# EAGLE design Breakout_AMT630 (EAGLE 8.3.2)
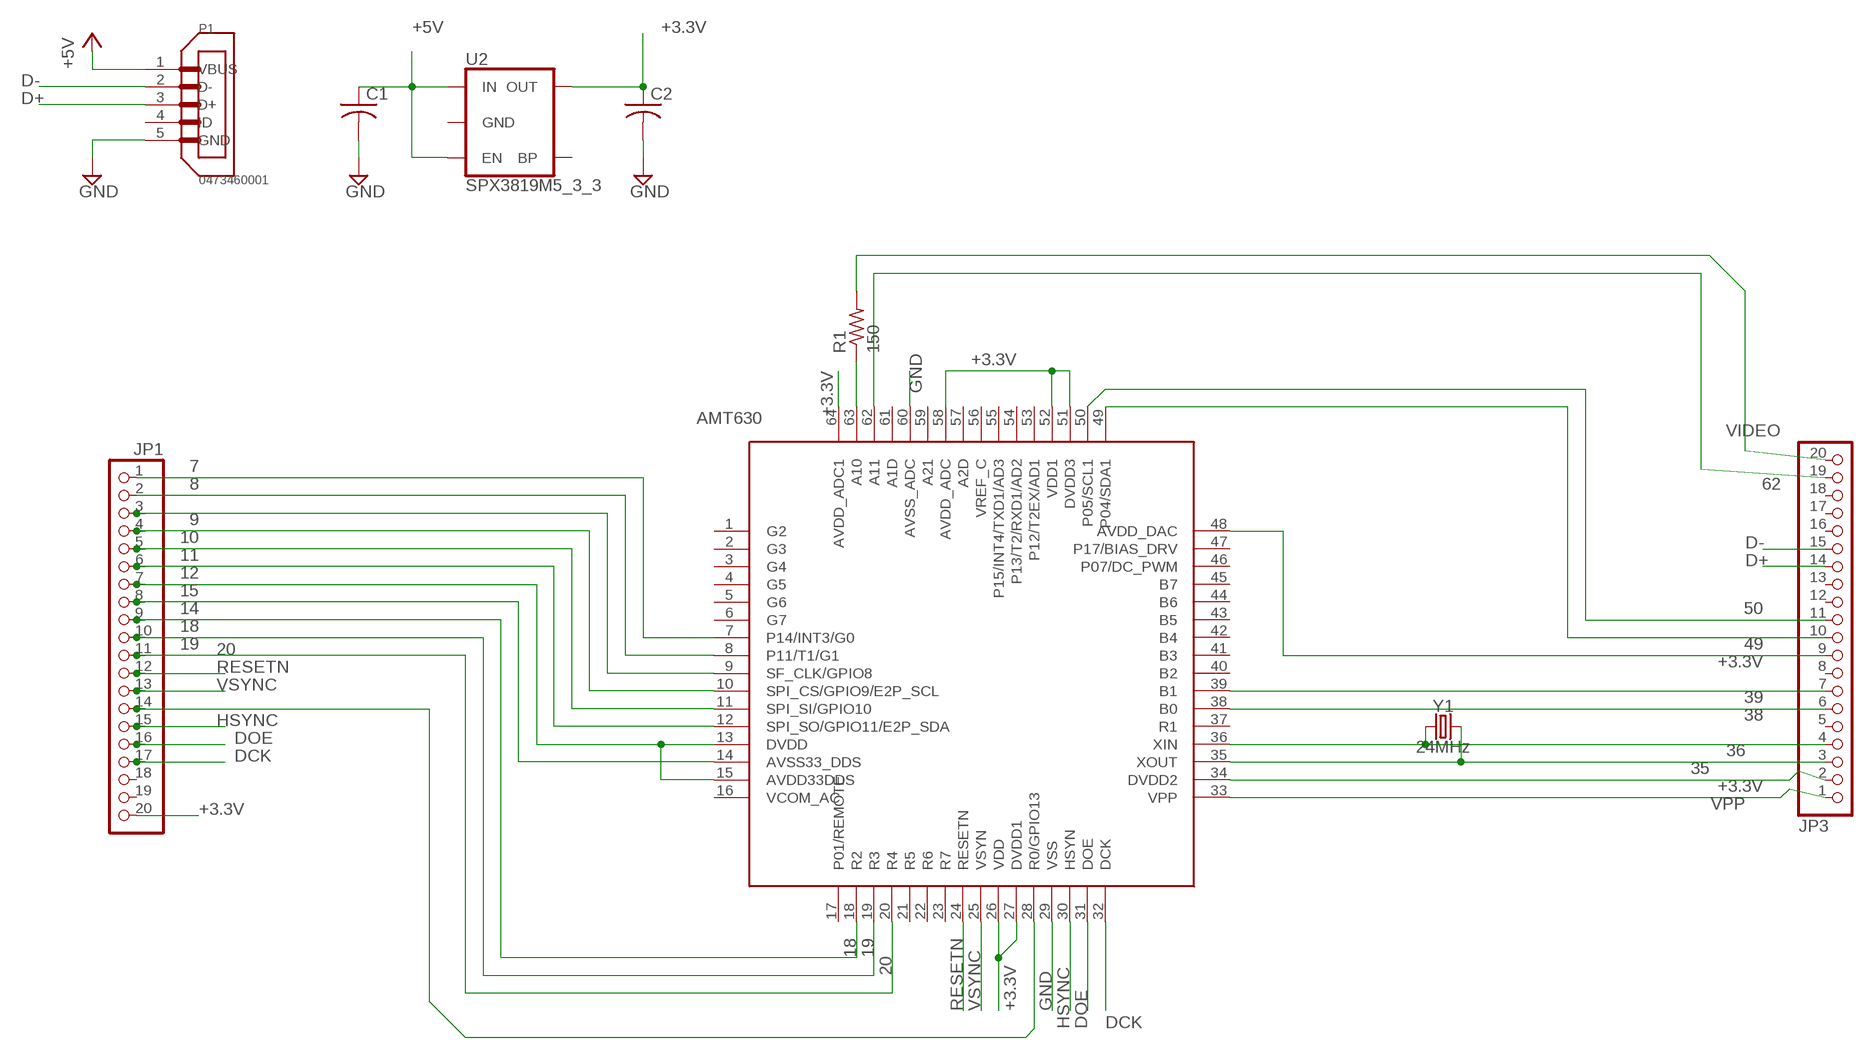
[diagram p0: schematic, sheet 1]

## Parts
C1  C-USC0402  [C0402]
C2  C-USC0402  [C0402]
JP1  PINHD-1X20-BIG  [1X20-BIG]
JP3  PINHD-1X20-BIG  [1X20-BIG]
P1  0473460001  [MOLEX_0473460001]
R1  150  R-US_R0402  [R0402]
U1  AMT630  [QFP50P1200X1200X160-64N]
U2  SPX3819M5_3_3  V_REG_SPX3819-SOT23-5  [SOT23-5]
Y1  24MHz  CRYSTAL-24MHZ"  [CRYSTAL-SMD-5X3.2-4PAD]

## Nets
7: JP1.1 U1.7(P14/INT3/G0)
8: JP1.2 U1.8(P11/T1/G1)
9: JP1.3 U1.9(SF_CLK/GPIO8)
10: JP1.4 U1.10(SPI_CS/GPIO9/E2P_SCL)
11: JP1.5 U1.11(SPI_SI/GPIO10)
12: JP1.6 U1.12(SPI_SO/GPIO11/E2P_SDA)
14: JP1.8 U1.14(AVSS33_DDS)
15: JP1.7 U1.13(DVDD) U1.15(AVDD33DDS)
18: JP1.9 U1.18(R2)
19: JP1.10 U1.19(R3)
20: JP1.11 U1.20(R4)
28: JP1.14 U1.28(R0/GPIO13)
35: JP3.3 U1.35(XOUT) Y1.3
36: JP3.4 U1.36(XIN) Y1.1
38: JP3.6 U1.38(B0)
39: JP3.7 U1.39(B1)
49: JP3.10 U1.49(P04/SDA1)
50: JP3.11 U1.50(P05/SCL1)
62: JP3.19 U1.62(A11)
+3.3V: C2.1 JP1.20 JP3.2 JP3.9 U1.26(VDD) U1.27(DVDD1) U1.34(DVDD2) U1.48(AVDD_DAC) U1.51(DVDD3) U1.52(VDD1) U1.58(AVDD_ADC) U1.64(AVDD_ADC1) U2.5(OUT)
+5V: C1.1 P1.1(VBUS) U2.1(IN) U2.3(EN)
D+: JP3.14 P1.3(D+)
D-: JP3.15 P1.2(D-)
DCK: JP1.17 U1.32(DCK)
DOE: JP1.16 U1.31(DOE)
GND: C1.2 C2.2 P1.5(GND) U1.29(VSS) U1.60(AVSS_ADC)
HSYNC: JP1.15 U1.30(HSYN)
N$15: R1.1 U1.63(A10)
RESETN: JP1.12 U1.24(RESETN)
VIDEO: JP3.20 R1.2
VPP: JP3.1 U1.33(VPP)
VSYNC: JP1.13 U1.25(VSYN)
Unconnected: JP1.18 JP1.19 JP3.5 JP3.8 JP3.12 JP3.13 JP3.16 JP3.17 JP3.18 P1.4(ID) U1.1(G2) U1.2(G3) U1.3(G4) U1.4(G5) U1.5(G6) U1.6(G7) U1.16(VCOM_AC) U1.17(P01/REMOTE) U1.21(R5) U1.22(R6) U1.23(R7) U1.37(R1) U1.40(B2) U1.41(B3) U1.42(B4) U1.43(B5) U1.44(B6) U1.45(B7) U1.46(P07/DC_PWM) U1.47(P17/BIAS_DRV) U1.53(P12/T2EX/AD1) U1.54(P13/T2/RXD1/AD2) U1.55(P15/INT4/TXD1/AD3) U1.56(VREF_C) U1.57(A2D) U1.59(A21) U1.61(A1D) U2.2(GND) U2.4(BP)

## Library data of the parts
C1 C2 = adafruit:C-US: CAPACITOR, American symbol
JP1 JP3 = adafruit:PINHD-1X20: PIN HEADER
P1 = 0473460001:0473460001: Conn Micro USB Type B RCP 5 POS 0.65mm Solder RA SMD 5 Terminal 1 Port T/R; AVAILABILITY: Good; DESCRIPTION: DEK 5 FW 1-50. Terminal markers, Card, 5 x 5 mm, Polyamide, Colour: White GTIN (EAN): 4008190135157; MF: Weidmuller; MP: 0473460001; PACKAGE: None; PRICE: 2.87 USD
R1 = rcl:R-US_: RESISTOR, American symbol
U1 = amt630:AMT630; OC_NEWARK: unknown
U2 = SparkFun-IC-Power:V_REG_SPX3819: SPX3819 Voltage Regulator 3.3V 500mA, 16V input Datasheet <https://www.exar.com/content/document.ashx?id=22106> SparkFun Products: SparkFun Serial Controlled Motor Driver <https://www.sparkfun.com/products/13911>; PROD_ID: VREG-13321
Y1 = SparkFun-Clocks:CRYSTAL-24MHZ: 24MHz Crystal Datasheet <http://www.sparkfun.com/datasheets/Components/AT-SMD-5x3.pdf> Frequency: 24MHz Frequency Tolerance: ±20ppm Load Capacitance: 12pF SparkFun Products: USB Bit Whacker <https://www.sparkfun.com/products/762>; PROD_ID: XTAL-08298; SF_ID: COM-08581

## Board
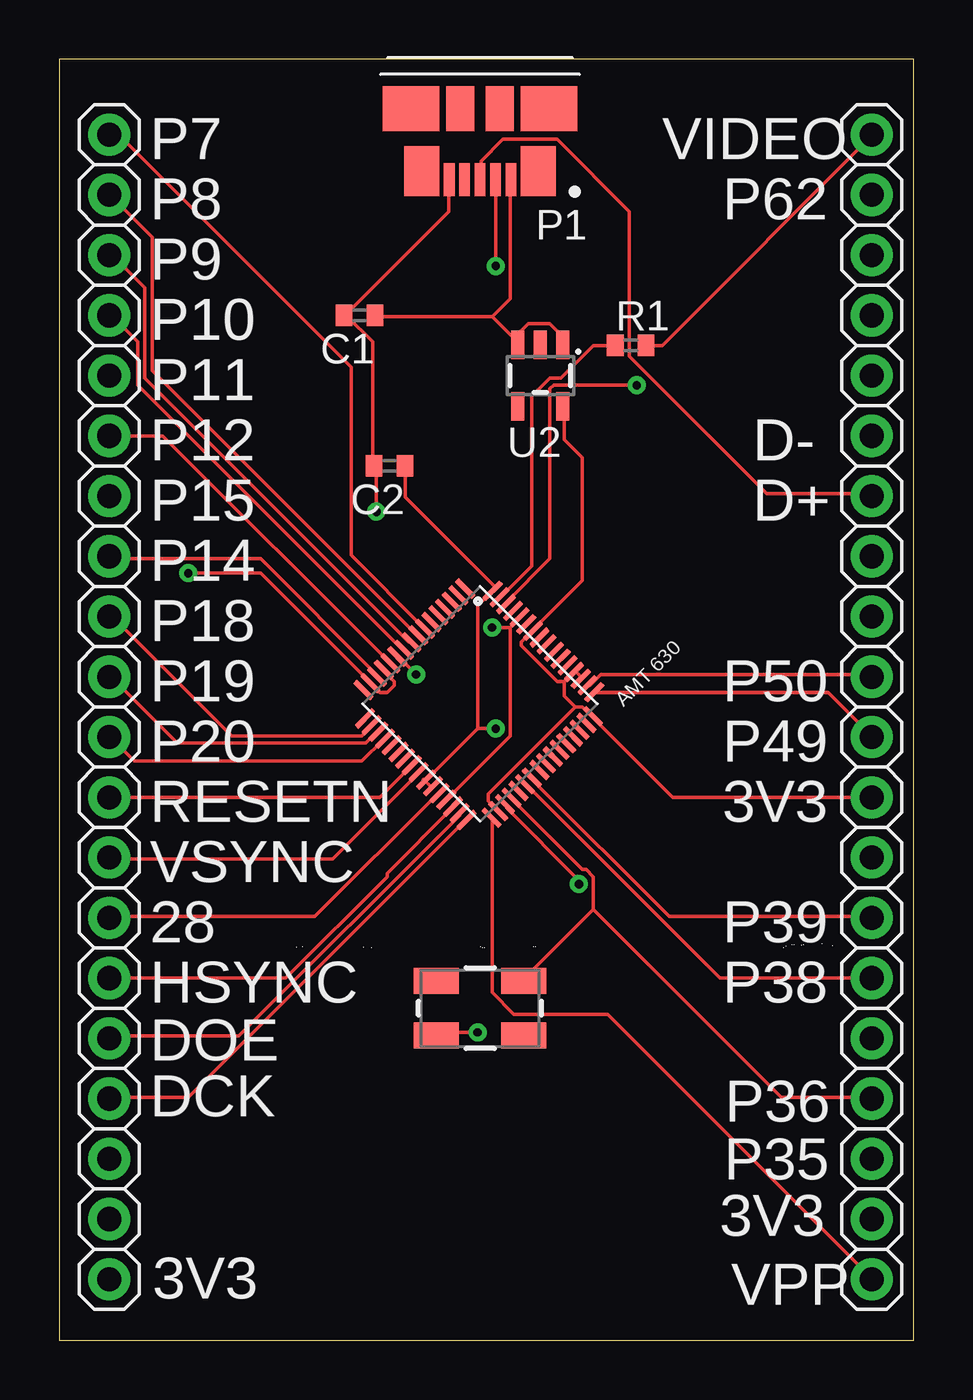
[diagram p1: board, top side]
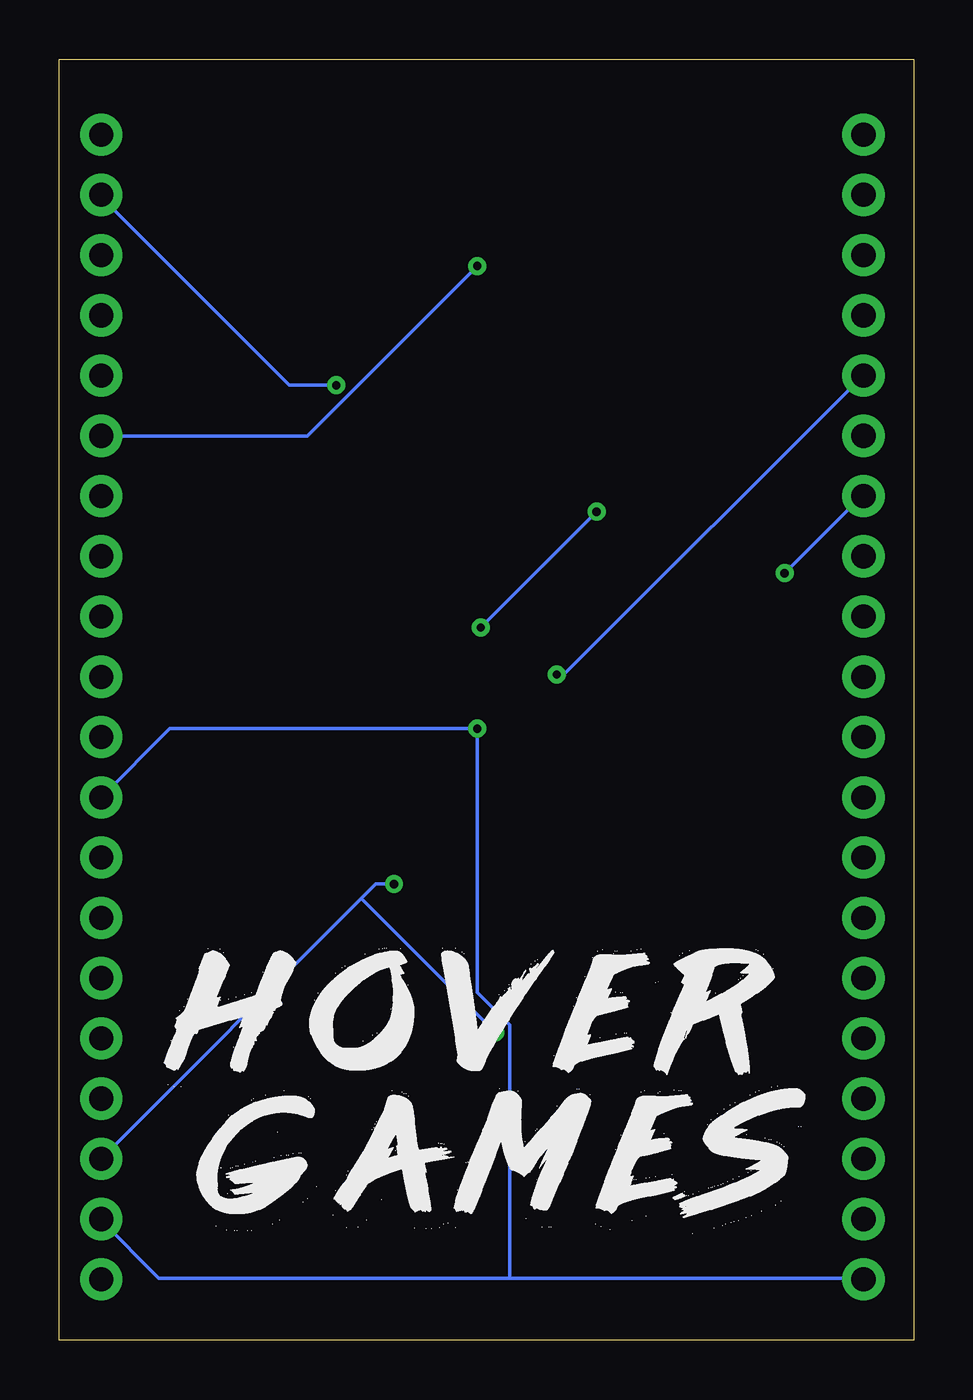
[diagram p2: board, bottom side, seen from below]

Size 36 x 54 mm. Coordinates in mm from the lower left corner, seen from the top.
Outline: 0,0 36,0 36,54 0,54 0,0
Copper layers (1*16): Top 0.035mm / dielectric 1.5mm / Bottom 0.035mm
Design rules "default": minimum track width 6mil, minimum drill 0.35mm, track to track 6mil, track to pad 6mil, pad to pad 6mil, via to via 6mil, smd to smd 6mil, copper to edge 40mil, drill to drill 6mil, minimum pad ring 10mil, minimum via ring 8mil, stop-mask expansion 4mil, vias tented up to drill 0mil, thermal gap 10mil

### Footprints (pad centres in the part's own frame; a part is rotated, then mirrored left to right if it is on the bottom)
C0402 = smd 0.7 x 0.9: 1 -0.65,0; 2 0.65,0
1X20-BIG = drill 1.016 pad 1.778: 1 -24.13,0; 2 -21.59,0; 3 -19.05,0; 4 -16.51,0; 5 -13.97,0; 6 -11.43,0; 7 -8.89,0; 8 -6.35,0; 9 -3.81,0; 10 -1.27,0; 11 1.27,0; 12 3.81,0; 13 6.35,0; 14 8.89,0; 15 11.43,0; 16 13.97,0; 17 16.51,0; 18 19.05,0; 19 21.59,0; 20 24.13,0
MOLEX_0473460001 = smd 0.45 x 1.38: 1 -1.3,0; 2 -0.65,0; 3 0,0; 4 0.65,0; 5 1.3,0 | smd 1.475 x 2.1: P1 -2.462,-0.36; P2 2.462,-0.36 | smd 2.375 x 1.9: P3 -2.913,-2.99; P6 2.913,-2.99 | smd 1.175 x 1.9: P4 -0.838,-2.99; P5 0.838,-2.99
R0402 = smd 0.7 x 0.9: 1 -0.65,0; 2 0.65,0
QFP50P1200X1200X160-64N = smd 0.2 x 0.998: 1 0.502,-0.381; 2 0.901,-0.381; 3 1.301,-0.381; 4 1.701,-0.381; 5 2.101,-0.381; 6 2.501,-0.381; 7 2.9,-0.381; 8 3.3,-0.381; 9 3.7,-0.381; 10 4.154,-0.381; 11 4.554,-0.381; 12 4.954,-0.381; 13 5.353,-0.381; 14 5.753,-0.381; 15 6.153,-0.381; 16 6.553,-0.381; 33 6.553,7.239; 34 6.153,7.239; 35 5.753,7.239; 36 5.353,7.239; 37 4.954,7.239; 38 4.554,7.239; 39 4.154,7.239; 40 3.7,7.239; 41 3.3,7.239; 42 2.9,7.239; 43 2.501,7.239; 44 2.101,7.239; 45 1.701,7.239; 46 1.301,7.239; 47 0.901,7.239; 48 0.502,7.239 | smd 0.998 x 0.2: 17 7.366,0.502; 18 7.366,0.901; 19 7.366,1.301; 20 7.366,1.701; 21 7.366,2.101; 22 7.366,2.501; 23 7.366,2.9; 24 7.366,3.3; 25 7.366,3.7; 26 7.366,4.154; 27 7.366,4.554; 28 7.366,4.954; 29 7.366,5.353; 30 7.366,5.753; 31 7.366,6.153; 32 7.366,6.553; 49 -0.254,6.553; 50 -0.254,6.153; 51 -0.254,5.753; 52 -0.254,5.353; 53 -0.254,4.954; 54 -0.254,4.554; 55 -0.254,4.154; 56 -0.254,3.7; 57 -0.254,3.3; 58 -0.254,2.9; 59 -0.254,2.501; 60 -0.254,2.101; 61 -0.254,1.701; 62 -0.254,1.301; 63 -0.254,0.901; 64 -0.254,0.502
SOT23-5 = smd 0.55 x 1.2: 1 -0.95,-1.3; 2 0,-1.3; 3 0.95,-1.3; 4 0.95,1.3; 5 -0.95,1.3
CRYSTAL-SMD-5X3.2-4PAD = smd 1.9 x 1.1: 1 -1.85,-1.15; 2 1.85,-1.15; 3 1.85,1.15; 4 -1.85,1.15

### Placement (x,y rotation side)
C1  12.65,43.21 180 top
C2  13.92,36.86 180 top
JP1  2.11,26.7 270 top
JP3  34.24,26.7 90 top
P1  17.73,48.92 180 top
R1  24.08,41.94 0 top
U1  17.73,31.78 225 top
U2  20.27,40.67 180 top
Y1  17.73,14 180 top

### Tracks (layer width: path | path; a pad name or v marks a point on that pad's centre or on a via)
7
  Top 0.152: U1.7 15.34,30.05 12.29,33.1 12.29,41.02 2.54,50.77 2.23,50.77 JP1.1
8
  Top 0.152: U1.8 15.04,29.74 3.91,40.87 3.91,46.51 2.23,48.18 JP1.2
9
  Top 0.152: U1.9 14.73,29.44 3.61,40.56 3.61,44.37 2.23,45.75 JP1.3
10
  Top 0.152: U1.10 14.43,29.13 3.3,40.26 3.3,42.09 2.23,43.15 JP1.4
11  (via drill 0.35)
  Top 0.152: v15.04,28.07 14.27,28.83 U1.11
  Bottom 0.152: v15.04,28.07 14.73,28.07 2.23,40.56 JP1.5
12
  Top 0.152: JP1.6 4.37,38.13 13.82,28.68 U1.12
14
  Top 0.152: U1.14 13.36,28.07 8.48,32.94 2.23,32.94 JP1.8
15  (via drill 0.35)
  Top 0.152: U1.13 13.66,28.22 14.12,27.76 14.12,27.61 13.82,27.31 13.51,27.31 13.21,27.61 U1.15 13.06,27.76 8.48,32.33 v5.44,32.33
  Bottom 0.152: v5.44,32.33 2.23,35.53 JP1.7
18
  Top 0.152: U1.18 13.06,25.78 12.75,25.48 7.26,25.48 2.23,30.51 JP1.9
19
  Top 0.152: U1.19 13.36,25.63 12.9,25.17 4.98,25.17 2.23,27.91 JP1.10
20
  Top 0.152: U1.20 13.66,25.32 12.75,24.41 3.15,24.41 2.23,25.32 JP1.11
28
  Top 0.152: U1.28 15.95,23.04 10.77,17.86 2.23,17.86 JP1.14
35  (via drill 0.35)
  Top 0.152: v21.89,19.23 21.89,19.38 18.85,22.43 18.85,22.58 U1.35 | v17.63,12.98 15.95,12.98 Y1.3
  Bottom 0.152: v21.89,19.23 22.66,19.23 23.27,18.62 | JP3.3 23.27,18.62 | 23.27,18.62 v17.63,12.98
36
  Top 0.152: 22.5,18.16 22.5,19.53 22.2,19.84 22.05,19.84 19.15,22.73 U1.36 | 22.5,18.16 19.61,15.27 Y1.1 | 22.5,18.16 30.43,10.24 34.24,10.24 JP3.4
38
  Top 0.152: JP3.6 27.84,15.27 19.76,23.34 U1.38
39
  Top 0.152: U1.39 19.91,23.65 25.7,17.86 34.24,17.86 JP3.7
49
  Top 0.152: U1.49 22.66,27.31 32.41,27.31 34.24,25.48 JP3.10
50
  Top 0.152: U1.50 22.35,27.61 22.81,28.07 34.24,28.07 JP3.11
62  (via drill 0.35)
  Top 0.152: v24.33,40.26 20.83,40.26 20.68,40.11 20.68,32.94 18.85,31.12 U1.62
  Bottom 0.152: v24.33,40.26 26.31,40.26 34.24,48.18 JP3.19
+3.3V  (via drill 0.35)
  Top 0.152: U1.27 15.65,23.34 15.34,23.65 U1.26 15.49,23.65 17.63,25.78 | C2.1 14.58,36.75 14.58,35.53 18.39,31.72 U1.64 18.24,31.57 17.63,30.96 17.63,25.78 | U1.51 22.05,27.91 21.74,28.22 U1.52 21.59,28.07 21.28,27.76 | 21.28,27.76 20.98,27.76 19.46,29.29 19.46,29.44 19.91,29.9 U1.58 20.07,30.05 22.05,32.03 22.05,37.21 21.28,37.97 21.28,39.34 U2.5 | 21.74,26.7 18.08,23.04 18.08,22.73 18.39,22.43 U1.34 | 21.74,26.7 22.05,26.7 22.35,26.39 U1.48 22.5,26.24 25.86,22.89 JP3.9 | 21.28,27.76 21.28,27.15 21.74,26.7 | v18.39,25.78 17.63,25.78
  Bottom 0.152: JP3.9 31.34,25.78 v18.39,25.78 18.39,14.66 17.02,13.28 17.02,2.62 | 17.02,2.62 31.8,2.62 34.24,5.05 JP3.2 | 17.02,2.62 2.23,2.62 JP1.20
+5V
  Top 0.152: 18.24,43.15 13.36,43.15 C1.1 | 19.15,42.24 19.3,42.09 U2.3 19.15,42.24 | 19.15,42.24 18.24,43.15 | 19.15,42.24 19.76,42.85 20.68,42.85 21.13,42.39 21.13,42.09 U2.1 | 18.24,43.15 19,43.92 19,48.79 P1.1
D+
  Top 0.152: P1.3 17.78,48.95 17.78,49.71 18.69,50.62 20.98,50.62 24.03,47.57 24.03,41.48 29.82,35.69 34.24,35.69 JP3.14
D-  (via drill 0.35)
  Top 0.152: v18.39,45.29 18.39,48.79 P1.2
  Bottom 0.152: v18.39,45.29 25.55,38.13 JP3.15
DCK
  Top 0.152: U1.32 17.02,21.82 5.44,10.24 2.23,10.24 JP1.17
DOE
  Top 0.152: U1.31 16.87,22.12 7.57,12.83 2.23,12.83 JP1.16
GND  (via drill 0.35)
  Top 0.152: 19,30.05 19,25.48 16.41,22.89 U1.29 | 19,30.05 19.3,30.35 U1.60 | P1.5 16.41,48.79 16.41,47.57 12.14,43.31 C1.2 12.14,43.15 13.21,42.09 13.21,36.91 C2.2 13.36,36.75 v13.36,34.93 | v18.24,30.05 19,30.05
  Bottom 0.152: v13.36,34.93 v18.24,30.05
HSYNC
  Top 0.152: JP1.15 9.55,15.27 13.82,19.53 13.82,19.69 16.56,22.43 U1.30
N$15
  Top 0.152: R1.1 22.5,41.94 21.13,40.56 20.68,40.56 19.91,39.8 19.91,32.64 18.69,31.42 U1.63
RESETN
  Top 0.152: JP1.12 13.51,22.89 14.73,24.1 U1.24
VIDEO
  Top 0.152: R1.2 25.4,41.94 34.24,50.77 JP3.20
VPP
  Top 0.152: U1.33 18.24,21.97 18.24,14.66 19.15,13.74 23.11,13.74 34.24,2.62 JP3.1
VSYNC
  Top 0.152: U1.25 15.04,23.8 11.53,20.29 2.23,20.29 JP1.13

### Text on the board
tNames: P7 | VIDEO | P8 | P62 | P9 | P10 | P11 | P12 | D- | P15 | D+ | P14 | P18 | P19 | P50 | P20 | P49 | RESETN | 3V3 | VSYNC | 28 | P39 | HSYNC | P38 | DOE | DCK | P36 | P35 | 3V3 | 3V3 | VPP